# Altium schematic sheet IMU.SchDoc
size A4
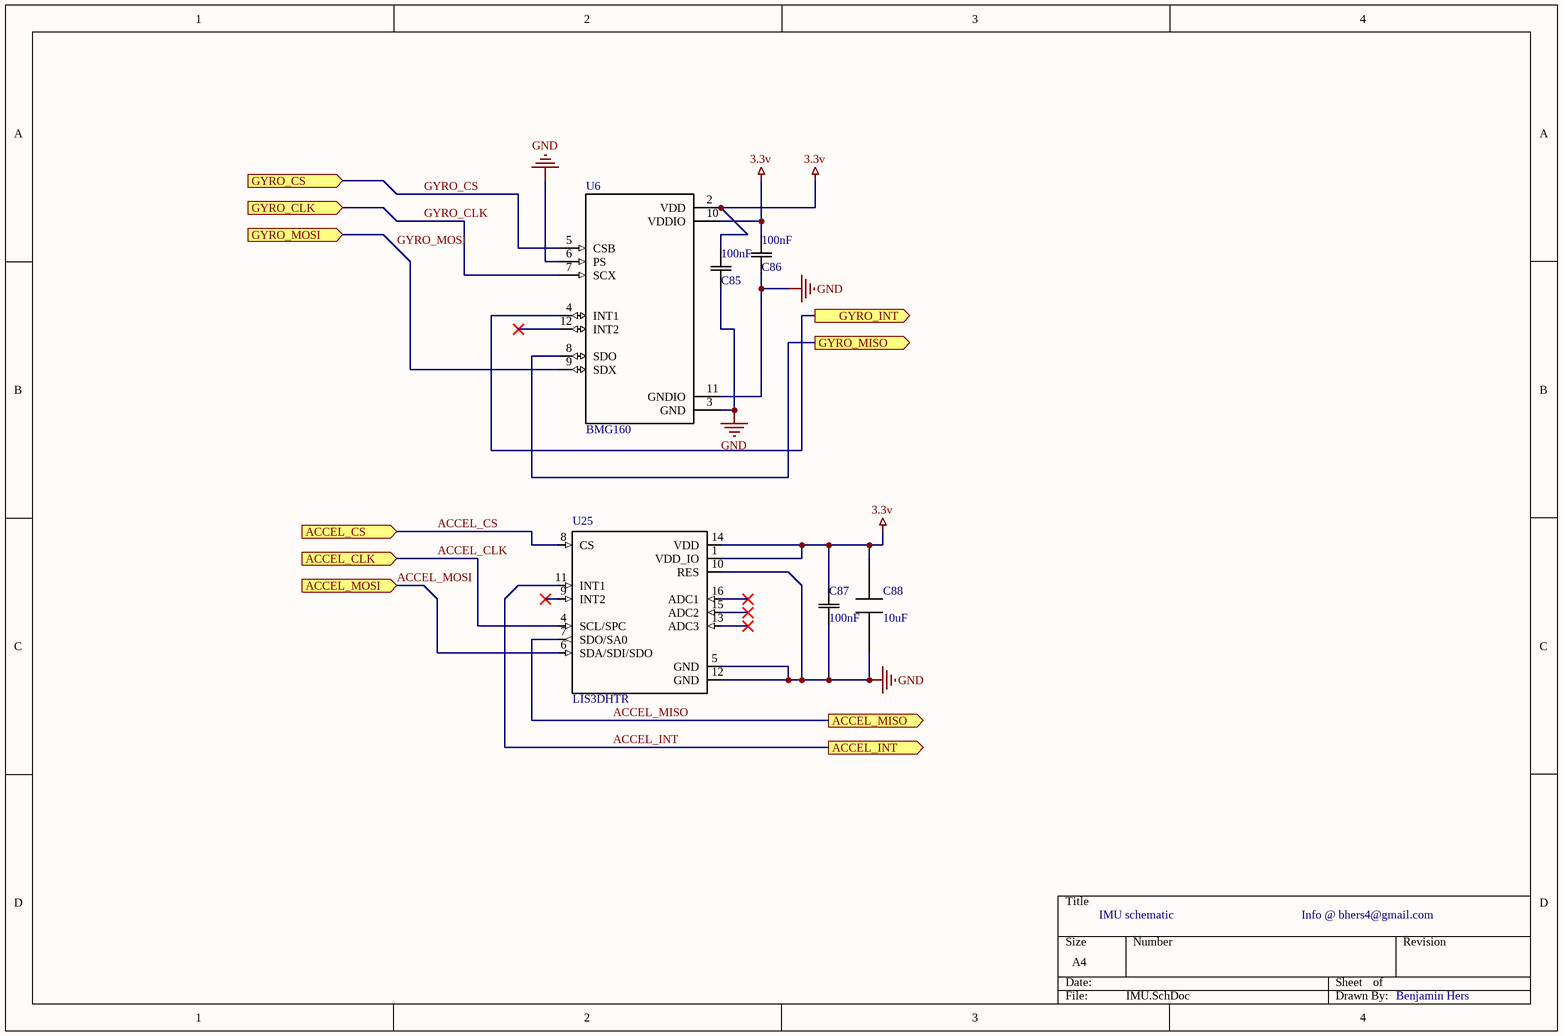
[diagram p0: IMU.SchDoc]

## Parts
C85  100nF  [CAPC2013X110N]
C86  100nF  [CAPC2013X110N]
C87  100nF  [CAPC2013X110N]
C88  10uF  [CAPC3216X100N]
U6  BMG160  [OFN50P300X300X100-12N]
U25  LIS3DHTR  [LGA16R50P5X3_300X300X100N]

## Ports
ACCEL_CLK (in), ACCEL_CS (in), ACCEL_INT (out), ACCEL_MISO (out), ACCEL_MOSI (in), GYRO_CLK (in), GYRO_CS (in), GYRO_INT (out), GYRO_MISO (out), GYRO_MOSI (in)

## Nets
3.3v: C85.1(C1) C86.1(C1) C87.2(C2) U6.2(VDD) U6.10(VDDIO) U25.1(VDD_IO) U25.14(VDD)
GND: C85.2(C2) C86.2(C2) C87.1(C1) U6.3(GND) U6.6(PS) U6.11(GNDIO) U25.5(GND) U25.10(RES) U25.12(GND)
ACCEL_CLK: U25.4(SCL/SPC) ; port ACCEL_CLK
ACCEL_CS: U25.8(CS) ; port ACCEL_CS
ACCEL_INT: U25.11(INT1) ; port ACCEL_INT
ACCEL_MISO: U25.7(SDO/SA0) ; port ACCEL_MISO
ACCEL_MOSI: U25.6(SDA/SDI/SDO) ; port ACCEL_MOSI
GYRO_CLK: U6.7(SCX) ; port GYRO_CLK
GYRO_CS: U6.5(CSB) ; port GYRO_CS
GYRO_INT: U6.4(INT1) ; port GYRO_INT
GYRO_MISO: U6.8(SDO) ; port GYRO_MISO
GYRO_MOSI: U6.9(SDX) ; port GYRO_MOSI

Not connected (* = marked no-connect by the designer): C88 In Out; U6 12(INT2)*; U25 9(INT2)* 13(ADC3)* 15(ADC2)* 16(ADC1)*

## Notes on the sheet
- IMU schematic
- Info @ bhers4@gmail.com
- Benjamin Hers

## Library data of the parts
C85-C87 = C0805C104K5RACTU: Capacitor; Ceramic; Cap; .100UF ; Tol+-10%; SMD; Vol-Rtg 50V; X7R, Tape/Reel; MF: Kemet; Package: 0805 Kemet; Availability: Good; MP: C0805C104K5RACTU; Price: 0.86 USD; Value: *
C88 = Component_1
U6 = BMG160: BMG160 Series 16 Bit 2000Â°/s 3-Axis Angular Rate Gyroscope Sensor 3 mm x 3 mm; MF: Bosch; MP: BMG160; Digi-Key_Purchase_URL: https://www.digikey.ca/product-detail/en/bosch-sensortec/BMG160/828-1042-1-ND/4196689?WT.z_cid=ref_snapeda; Package: VFLGA-12 Bosch; Digi-Key_Part_Number: 828-1042-1-ND; Value: *
U25 = LIS3DHTR: MEMS digital output motion sensor ultra low-power high performance 3-axes; MF: STMicroelectronics; Price: 0.99 USD; Package: LGA-16 STMicroelectronics; MP: LIS3DHTR; Value: *